# EAGLE design MotorDriver_Basic (EAGLE 9.5.2)
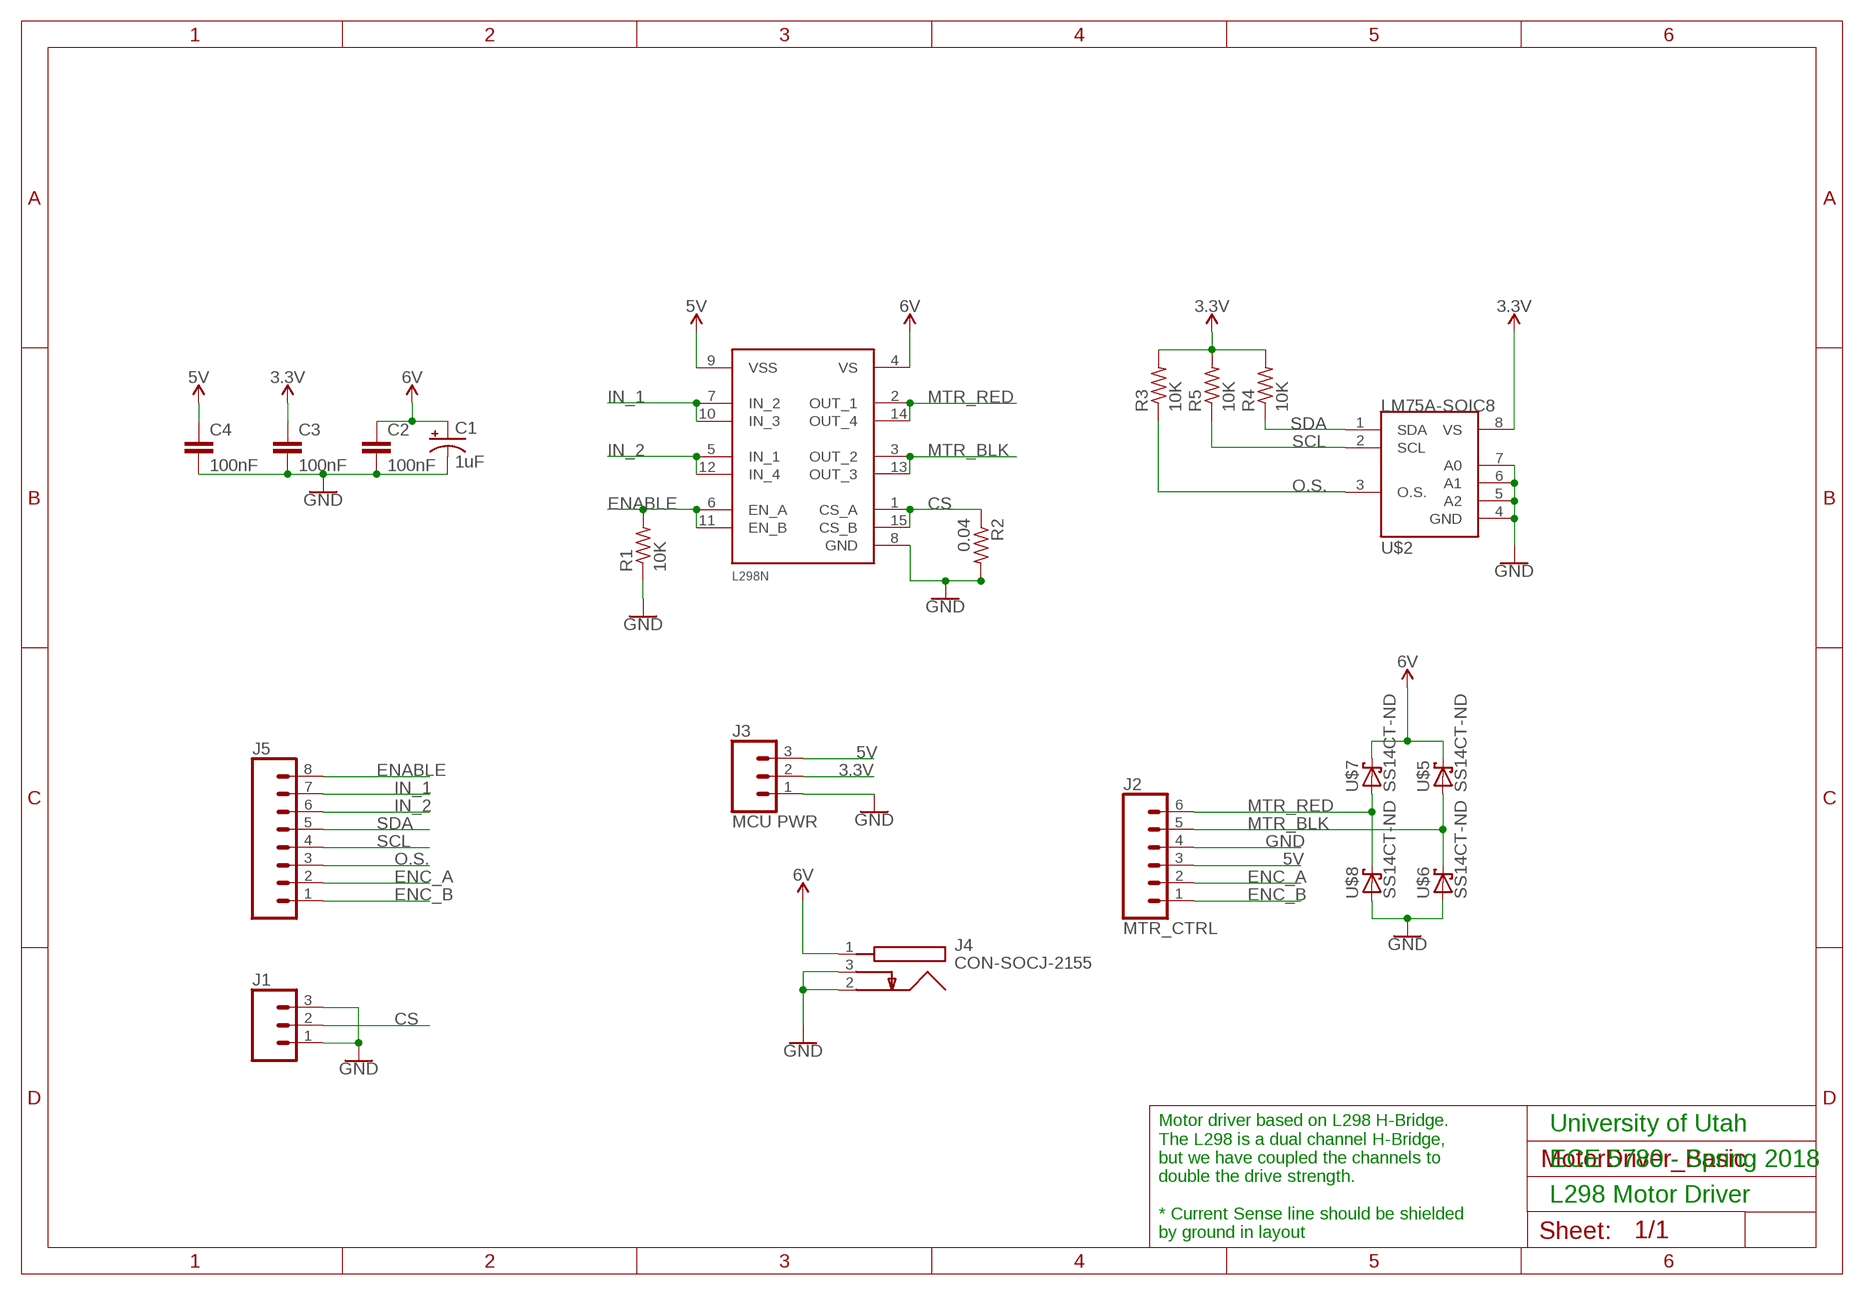
[diagram p0: schematic, sheet 1]

## Parts
C1  1uF  CPOL-USE2.5-6  [E2,5-6]
C2  100nF  C-EUC1206  [C1206]
C3  100nF  C-EUC1206  [C1206]
C4  100nF  C-EUC1206  [C1206]
J1  CONN_03  [1X03]
J2  MTR_CTRL  CONN_06SILK_FEMALE_PTH  [1X06]
J3  MCU PWR  CONN_03  [1X03]
J4  CON-SOCJ-2155  [CONSOCJ2155]
J5  CONN_08"  [1X08]
L298N  L298N-MULTIWATT15  [L298N-MULTIWATT15]
R1  10K  R-US_M1206  [M1206]
R2  0.04  R-US_M1206  [M1206]
R3  10K  R-US_M1206  [M1206]
R4  10K  R-US_M1206  [M1206]
R5  10K  R-US_M1206  [M1206]
U$2  LM75A-SOIC8  [SOIC-8]
U$5  SS14CT-ND  [SOD106A-W]
U$6  SS14CT-ND  [SOD106A-W]
U$7  SS14CT-ND  [SOD106A-W]
U$8  SS14CT-ND  [SOD106A-W]

## Nets
3.3V: C3.1 J3.2 R3.2 R4.2 R5.2 U$2.8(VS)
5V: C4.1 J2.3 J3.3 L298N.9(VSS)
CS: J1.2 L298N.1(CS_A) L298N.15(CS_B) R2.1
ENABLE: J5.8 L298N.6(EN_A) L298N.11(EN_B) R1.2
ENC_A: J2.2 J5.2
ENC_B: J2.1 J5.1
GND: C1.- C2.2 C3.2 C4.2 J1.1 J1.3 J2.4 J3.1 J4.2 J4.3 L298N.8(GND) R1.1 R2.2 U$2.4(GND) U$2.5(A2) U$2.6(A1) U$2.7(A0) U$6.A U$8.A
IN_1: J5.7 L298N.7(IN_2) L298N.10(IN_3)
IN_2: J5.6 L298N.5(IN_1) L298N.12(IN_4)
MTR_BLK: J2.5 L298N.3(OUT_2) L298N.13(OUT_3) U$5.A U$6.C
MTR_RED: J2.6 L298N.2(OUT_1) L298N.14(OUT_4) U$7.A U$8.C
O.S.: J5.3 R3.1 U$2.3(O.S.)
SCL: J5.4 R5.1 U$2.2(SCL)
SDA: J5.5 R4.1 U$2.1(SDA)
VCC: C1.+ C2.1 J4.1 L298N.4(VS) U$5.C U$7.C ; supply symbol labelled 6V

## Notes on the sheet
- University of Utah
- ECE 5780 - Spring 2018
- L298 Motor Driver
- Motor driver based on L298 H-Bridge. 
  The L298 is a dual channel H-Bridge, 
  but we have coupled the channels to 
  double the drive strength. 
  
  * Current Sense line should be shielded 
  by ground in layout

## Library data of the parts
C1 = rcl:CPOL-US: POLARIZED CAPACITOR, American symbol; SPICEPREFIX: C
C2-C4 = rcl:C-EU: CAPACITOR, European symbol; SPICEPREFIX: C
J1 J3 = SparkFun-Connectors:CONN_03: Multi connection point. Often used as Generic Header-pin footprint for 0.1 inch spaced/style header connections On any of the 0.1 inch spaced packages, you can populate with these: Break Away Headers - Straight <https://www.sparkfun.com/products/116> (PRT-00116) Break Away Male Headers - Right Angle <https://www.sparkfun.com/products/553> (PRT-00553) Female Headers <https://www.sparkfun.com/products/115> (PRT-00115) Break Away Headers - Machine Pin <https://www.sparkfun.com/products/117> (PRT-00117) Break Away Female Headers - Swiss Machine Pin <https://www.sparkfun.com/products/743> (PRT-00743) Stackable Header - 3 Pin (Female, 0.1") <https://www.sparkfun.com/products/13875> (PRT-13875) For SCREWTERMINALS and SPRING TERMINALS visit here: Screw Terimnals on SparkFun.com <https://www.sparkfun.com/search/results?term=Screw+Terminals> (5mm/3.5mm/2.54mm spacing) This device is also useful as a general connection point to wire up your design to another part of your project. Our various solder wires solder well into these plated through hole pads. Hook-Up Wire - Assortment (Stranded, 22 AWG) <https://www.sparkfun.com/products/11375> (PRT-11375) Hook-Up Wire - Assortment (Solid Core, 22 AWG) <https://www.sparkfun.com/products/11367> (PRT-11367) View the entire wire category on our website here <https://www.sparkfun.com/categories/141> Special notes: Molex polarized connector foot print use with SKU : PRT-08232 with associated crimp pins and housings.
J2 = SparkFun-Connectors:CONN_06: Multi connection point. Often used as Generic Header-pin footprint for 0.1 inch spaced/style header connections On any of the 0.1 inch spaced packages, you can populate with these: Break Away Headers - Straight <https://www.sparkfun.com/products/116> (PRT-00116) Break Away Male Headers - Right Angle <https://www.sparkfun.com/products/553> (PRT-00553) Female Headers <https://www.sparkfun.com/products/115> (PRT-00115) Break Away Headers - Machine Pin <https://www.sparkfun.com/products/117> (PRT-00117) Break Away Female Headers - Swiss Machine Pin <https://www.sparkfun.com/products/743> (PRT-00743) Arduino Stackable Header - 6 Pin <https://www.sparkfun.com/products/9280> (PRT-09280) For SCREWTERMINALS and SPRING TERMINALS visit here: Screw Terimnals on SparkFun.com <https://www.sparkfun.com/search/results?term=Screw+Terminals> (5mm/3.5mm/2.54mm spacing) This device is also useful as a general connection point to wire up your design to another part of your project. Our various solder wires solder well into these plated through hole pads. Hook-Up Wire - Assortment (Stranded, 22 AWG) <https://www.sparkfun.com/products/11375> (PRT-11375) Hook-Up Wire - Assortment (Solid Core, 22 AWG) <https://www.sparkfun.com/products/11367> (PRT-11367) View the entire wire category on our website here <https://www.sparkfun.com/categories/141>; PROD_ID: CONN-08437
J4 = SamacSys_Parts:CON-SOCJ-2155: DC Power Connectors Power Jack/Connector 2.1mm x 5.5mm Source: Datasheet <http://www.produktinfo.conrad.com/datenblaetter/1500000-1599999/001582350-da-01-en-DC_EINBAUBUCHSE__SCHALTER_GESCHLOSSEN.pdf>; DESCRIPTION: DC Power Connectors Power Jack/Connector 2.1mm x 5.5mm; HEIGHT: 11mm; MANUFACTURER_NAME: Gravitech; MANUFACTURER_PART_NUMBER: CON-SOCJ-2155; MOUSER_PART_NUMBER: 992-CON-SOCJ-2155; MOUSER_PRICE-STOCK: https://www.mouser.co.uk/ProductDetail/Gravitech/CON-SOCJ-2155/?qs=fkzBJ5HM%252BdCcpvFQyQZHtA%3D%3D
J5 = SparkFun-Connectors:CONN_08: Multi connection point. Often used as Generic Header-pin footprint for 0.1 inch spaced/style header connections On any of the 0.1 inch spaced packages, you can populate with these: Break Away Headers - Straight <https://www.sparkfun.com/products/116> (PRT-00116) Break Away Male Headers - Right Angle <https://www.sparkfun.com/products/553> (PRT-00553) Female Headers <https://www.sparkfun.com/products/115> (PRT-00115) Break Away Headers - Machine Pin <https://www.sparkfun.com/products/117> (PRT-00117) Break Away Female Headers - Swiss Machine Pin <https://www.sparkfun.com/products/743> (PRT-00743) Arduino Stackable Header - 8 Pin <https://www.sparkfun.com/products/9279> (PRT-09279) For SCREWTERMINALS and SPRING TERMINALS visit here: Screw Terimnals on SparkFun.com <https://www.sparkfun.com/search/results?term=Screw+Terminals> (5mm/3.5mm/2.54mm spacing) This device is also useful as a general connection point to wire up your design to another part of your project. Our various solder wires solder well into these plated through hole pads. Hook-Up Wire - Assortment (Stranded, 22 AWG) <https://www.sparkfun.com/products/11375> (PRT-11375) Hook-Up Wire - Assortment (Solid Core, 22 AWG) <https://www.sparkfun.com/products/11367> (PRT-11367) View the entire wire category on our website here <https://www.sparkfun.com/categories/141> Special notes: Molex polarized connector foot print use with SKU : PRT-08231 with associated crimp pins and housings. 1MM SMD Version SKU: PRT-10208 NOTES ON THE VARIANTS LOCK and LOCK_LONGPADS... This footprint was designed to help hold the alignment of a through-hole component (i.e. 6-pin header) while soldering it into place. You may notice that each hole has been shifted either up or down by 0.005 of an inch from it's more standard position (which is a perfectly straight line). This slight alteration caused the pins (the squares in the middle) to touch the edges of the holes. Because they are alternating, it causes a "brace" to hold the component in place. 0.005 has proven to be the perfect amount of "off-center" position when using our standard breakaway headers. Although looks a little odd when you look at the bare footprint, once you have a header in there, the alteration is very hard to notice. Also,if you push a header all the way into place, it is covered up entirely on the bottom side.; PROD_ID: CONN-08438
L298N = ECE5780-MotorDriver:L298N-MULTIWATT15
R1-R5 = rcl:R-US_: RESISTOR, American symbol; SPICEPREFIX: R
U$2 = L298_Motor_Driver_Lib_ECE5780:LM75A-SOIC8
U$5-U$8 = L298_Motor_Driver_Lib_ECE5780:SS14CT-ND: Schottky Diode: SS14CT-ND, 40V, 1A, DO-214AC, SMA

## Board
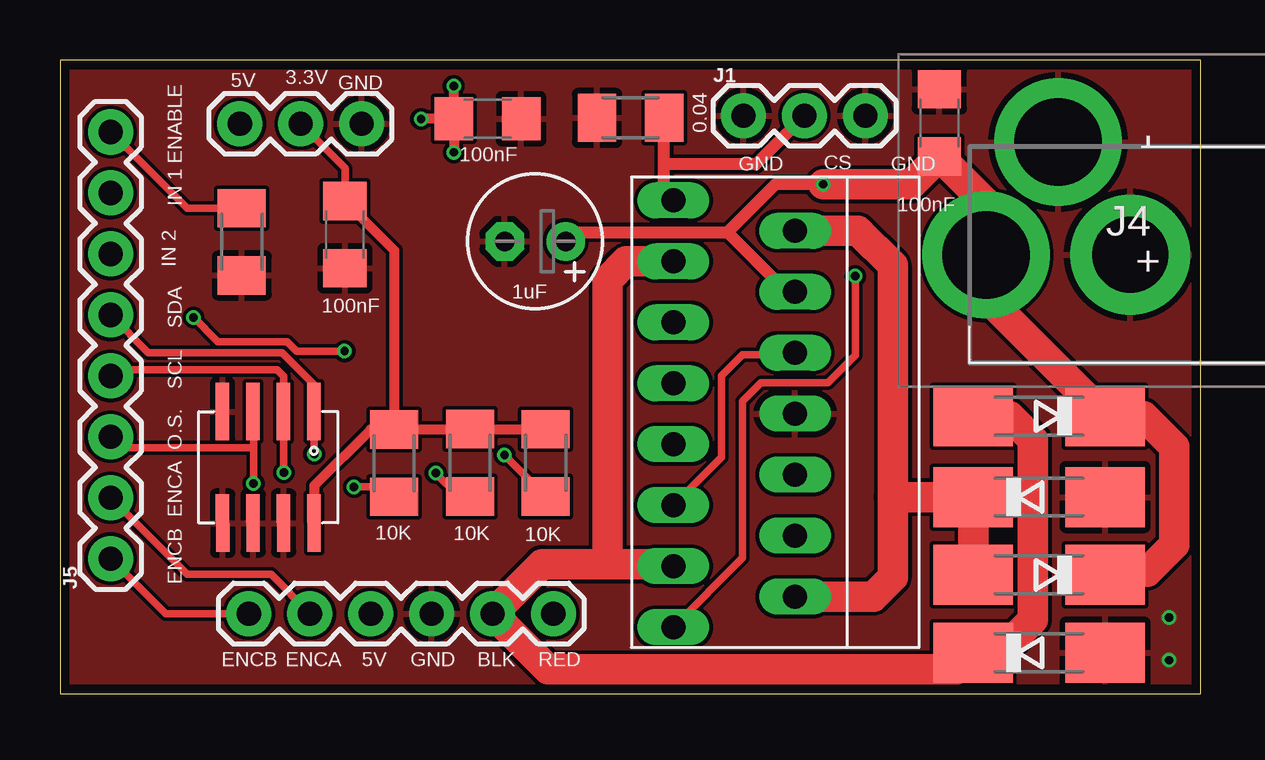
[diagram p1: board, top side]
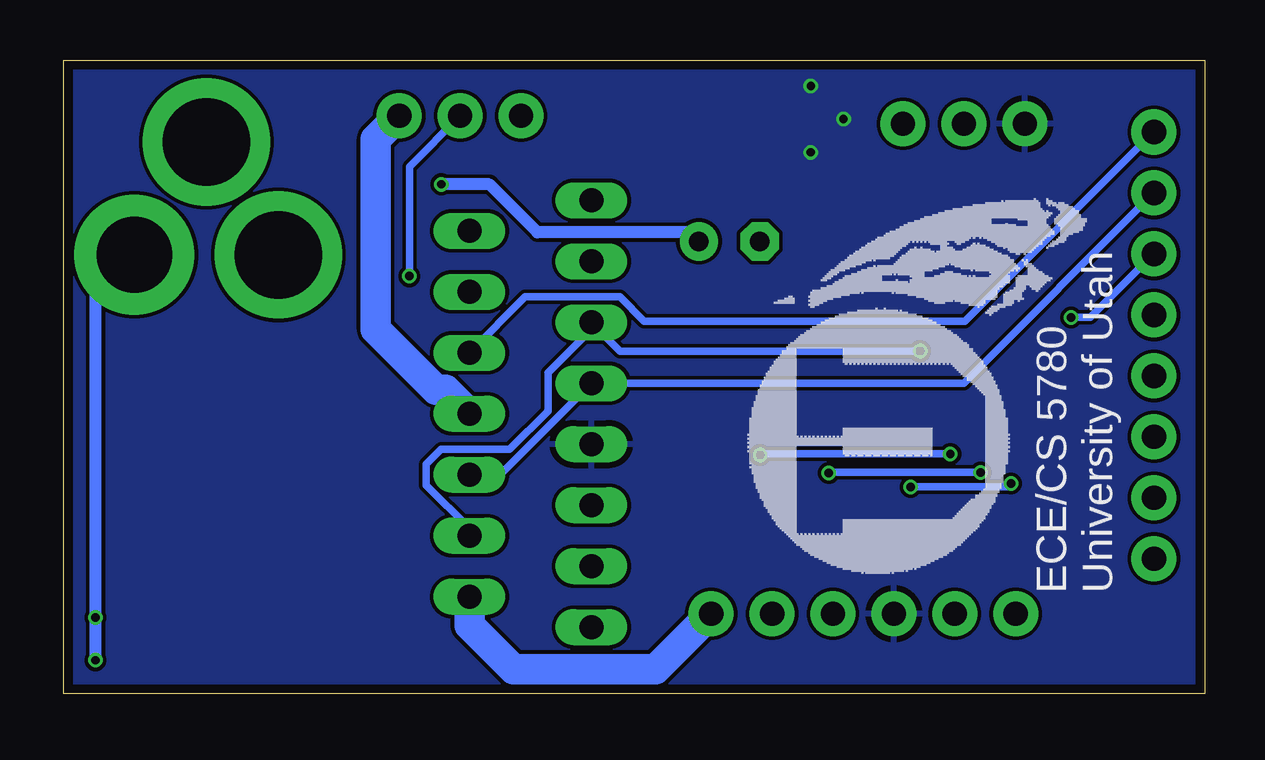
[diagram p2: board, bottom side, seen from below]

Size 47.55 x 26.4 mm. Coordinates in mm from the lower left corner, seen from the top.
Outline: 0,0 47.55,0 47.55,26.4 0,26.4 0,0
Copper layers (1*16): Top 0.035559375mm / dielectric 1.6mm / Bottom 0.035559375mm
Design rules "oshpark-2layer": minimum track width 6mil, minimum drill 10mil, track to track 6mil, track to pad 6mil, pad to pad 6mil, via to via 6mil, smd to smd 6mil, copper to edge 15mil, drill to drill 6mil, minimum pad ring 5mil, minimum via ring 5mil, stop-mask expansion 2.5mil, vias tented up to drill 0mil, thermal gap 10mil

### Footprints (pad centres in the part's own frame; a part is rotated, then mirrored left to right if it is on the bottom)
E2,5-6 = drill 0.813 pad 1.6: + -1.27,0 | drill 0.813 pad 1.6 octagon: - 1.27,0
C1206 = smd 1.6 x 1.8: 1 -1.4,0; 2 1.4,0
1X03 = drill 1.016 pad 1.88: 1 0,0; 2 2.54,0; 3 5.08,0
1X06 = drill 1.016 pad 1.88: 1 0,0; 2 2.54,0; 3 5.08,0; 4 7.62,0; 5 10.16,0; 6 12.7,0
CONSOCJ2155 = drill 3.64 pad 5.3: 1 0,0; 3 -3,-4.7 | drill 3.162 pad 5: 2 -6,0
1X08 = drill 1.016 pad 1.88: 1 0,0; 2 2.54,0; 3 5.08,0; 4 7.62,0; 5 10.16,0; 6 12.7,0; 7 15.24,0; 8 17.78,0
L298N-MULTIWATT15 = drill 1 pad 1.2 long: 1 9.03,2.25; 2 7.76,-2.83; 3 6.49,2.25; 4 5.22,-2.83; 5 3.95,2.25; 6 2.68,-2.83; 7 1.41,2.25; 8 0.14,-2.83; 9 -1.13,2.25; 10 -2.4,-2.83; 11 -3.67,2.25; 12 -4.94,-2.83; 13 -6.21,2.25; 14 -7.48,-2.83; 15 -8.75,2.25
M1206 = smd 1.6 x 2: 1 -1.4,0; 2 1.4,0
SOIC-8 = smd 2.388 x 0.559: 1 -2.54,1.905; 2 -2.54,0.635; 3 -2.54,-0.635; 4 -2.54,-1.905; 5 2.108,-1.905; 6 2.108,-0.635; 7 2.108,0.635; 8 2.108,1.905
SOD106A-W = smd 3.303 x 2.5: A 2.75,0; C -2.75,0

### Placement (x,y rotation side)
C1  19.81,18.84 180 top
C2  36.66,23.78 90 top
C3  11.88,19.12 270 top
C4  17.82,23.95 0 top
J1  28.49,24.07 0 top
J2  7.87,3.33 0 top
J3  12.57,23.74 180 top
J4  38.61,18.28 180 top
J5  2.11,5.62 90 top
L298N  27.81,11.52 90 top
R1  7.58,18.82 90 top
R2  23.79,23.99 180 top
R3  13.93,9.6 90 top
R4  20.25,9.61 90 top
R5  17.1,9.62 90 top
U$2  8.68,9.21 270.1 top
U$5  40.81,11.56 180 top
U$6  40.81,1.7 0 top
U$7  40.81,4.95 180 top
U$8  40.81,8.19 0 top

### Tracks (layer width: path | path; a pad name or v marks a point on that pad's centre or on a via)
3.3V
  Top 0.305: J3.2 11.88,21.9 C3.1
  Top 0.406: U$2.8 10.6,8.66 12.94,11 R3.2 | R4.2 R5.2 17.08,11 R3.2 | C3.1 13.93,18.47 R3.2
5V  (via drill 0.35)
  Top 0.406: C4.1 v16.42,22.56 v16.42,22.55 | C4.1 15.07,23.95 v15.05,23.94 | C4.1 v16.42,25.3 v16.41,25.31
  pour Bottom: -0.13,-0.13 47.62,-0.13 47.62,26.54 -0.13,26.54
CS  (via drill 0.35)
  Top 0.305: L298N.1 25.18,20.93 | L298N.15 28.45,5.65 28.45,12.18 29.21,12.95 32,12.95 33.15,14.09 v33.15,17.39
  Top 0.508: 25.18,22.04 R2.1 | J1.2 29,22.04 25.18,22.04 | 25.18,20.93 25.18,22.04
  Bottom 0.305: v33.15,17.39 33.15,21.96 J1.2
ENABLE
  Top 0.305: J5.8 5.29,20.22 R1.2 | L298N.6 30.64,14.11 28.44,14.11 27.57,13.24 27.57,9.85 L298N.11
  Bottom 0.305: J5.8 9.99,15.52 23.37,15.52 24.38,16.52 28.32,16.52 L298N.6
ENC_A
  Top 0.305: J2.2 10.41,3.35 8.8,4.97 5.31,4.97 J5.2
ENC_B
  Top 0.305: J5.1 4.41,3.33 J2.1
GND  (via drill 0.35)
  Bottom 0.508: v46.23,1.39 v46.23,3.17 46.23,16.66 J4.2
  Bottom 1.27: L298N.8 31.65,12.66 32.03,12.66 34.54,15.18 34.54,23.1 J1.3
  pour Top: -0.13,-0.13 47.62,-0.13 47.62,26.54 -0.13,26.54
IN_1
  Bottom 0.305: J5.7 10.04,12.93 L298N.7 29.37,9.12 L298N.10
IN_2  (via drill 0.35)
  Top 0.305: v5.56,15.67 6.57,14.67 9.46,14.67 9.86,14.27 v11.86,14.27
  Bottom 0.305: L298N.12 30.64,6.88 32.45,8.68 32.45,9.56 31.83,10.17 28.97,10.17 27.37,11.77 27.37,13.37 25.56,15.17 L298N.5 24.36,14.27 v11.86,14.27 | J5.6 4.76,15.67 v5.56,15.67
MTR_BLK
  Top 0.305: U$6.C 37.08,1.66 | 25.48,5.39 L298N.13
  Top 1.27: U$5.A 39.59,11.56 40.56,10.58 40.56,3.08 39.19,1.7 U$6.C 37.38,1.02 20.34,1.02 J2.5 20.09,5.39 22.81,5.39 | 22.81,5.39 25.48,5.39 | L298N.3 23.6,18.01 22.81,17.22 22.81,5.39
  Bottom 0.305: L298N.13 25.54,5.33 25.15,5.33
MTR_RED
  Top 1.27: U$7.A U$8.C 34.71,8.19 | L298N.2 33.27,19.28 34.71,17.84 34.71,8.19 | L298N.14 33.91,4.04 34.71,4.84 34.71,8.19
  Bottom 0.305: L298N.14 30.28,4.04 30.27,4.02
  Bottom 1.27: J2.6 22.88,1.02 28.81,1.02 30.64,2.85 L298N.14
O.S.  (via drill 0.35)
  Top 0.305: U$2.3 8.07,11.73 8.07,10.19 | 8.07,10.19 v8.07,8.75 | v12.26,8.61 13.23,8.61 | 8.07,10.19 8.01,10.25 2.56,10.25 J5.3
  Top 0.406: R3.1 13.64,8.2 13.23,8.61
  Bottom 0.305: v8.07,8.75 8.21,8.61 v12.26,8.61
SCL  (via drill 0.35)
  Top 0.305: v9.33,9.21 9.31,9.23 U$2.2 9.31,13.21 9.04,13.48 2.68,13.48 2.44,13.24 J5.4 | R5.1 16.63,8.22 v15.66,9.19
  Bottom 0.305: v9.33,9.21 15.64,9.21 v15.66,9.19
SDA  (via drill 0.35)
  Top 0.305: v18.53,9.94 v18.53,9.93 R4.1 | v10.6,9.98 v10.59,9.99 10.59,11.75 U$2.1 10.58,12.9 9.27,14.21 3.68,14.21 J5.5
  Bottom 0.305: v10.6,9.98 18.53,9.98 v18.53,9.94
VCC  (via drill 0.35)
  Top 0.305: L298N.4 30.41,16.74 30.26,16.88
  Top 0.508: C2.1 36.01,22.07 | v31.81,21.22 29.81,21.22 27.81,19.22 | 27.81,19.22 30.29,16.74 L298N.4 | C1.+ 21.45,19.22 27.81,19.22
  Top 1.27: U$7.C 43.7,5.08 45.33,5.08 46.44,6.2 46.44,10.29 45.17,11.56 U$5.C 38.61,16.51 J4.1 38.61,20.43 C2.1 35.5,21.22 v31.81,21.22
  Bottom 0.508: C1.+ 21.31,19.08 21.31,19.22 27.81,19.22 29.81,21.22 v31.81,21.22

### Text on the board
bPlace: ECE/CS 5780 / University of Utah
_tsilk: 5V | 3.3V | GND | - | ENABLE | GND | CS | GND | IN 1 | IN 2 | + | SDA | SCL | O.S. | ENCA | ENCB | ENCB | ENCA | 5V | GND | BLK | RED